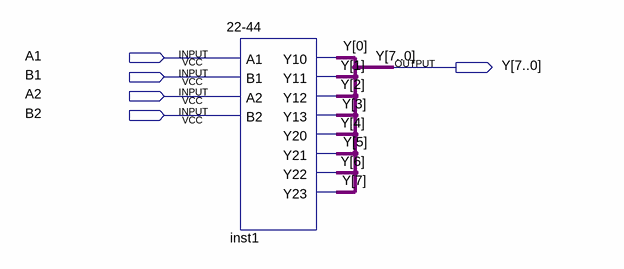
[diagram p0: schematic sheet]
// Quartus schematic 22-44_bus.bdf as structural Verilog: 1 symbols, 5 pins
module \22-44_bus  (
  input  A1,
  input  B1,
  input  A2,
  input  B2,
  output [7:0] Y
);

  \22-44  inst1 (
    .A1(A1), .B1(B1), .A2(A2), .B2(B2), .Y10(Y[0]), .Y11(Y[1]), .Y12(Y[2]), .Y13(Y[3]), .Y20(Y[4]),
    .Y21(Y[5]), .Y22(Y[6]), .Y23(Y[7]));
endmodule
